# EAGLE design ina (EAGLE 7.7.0)
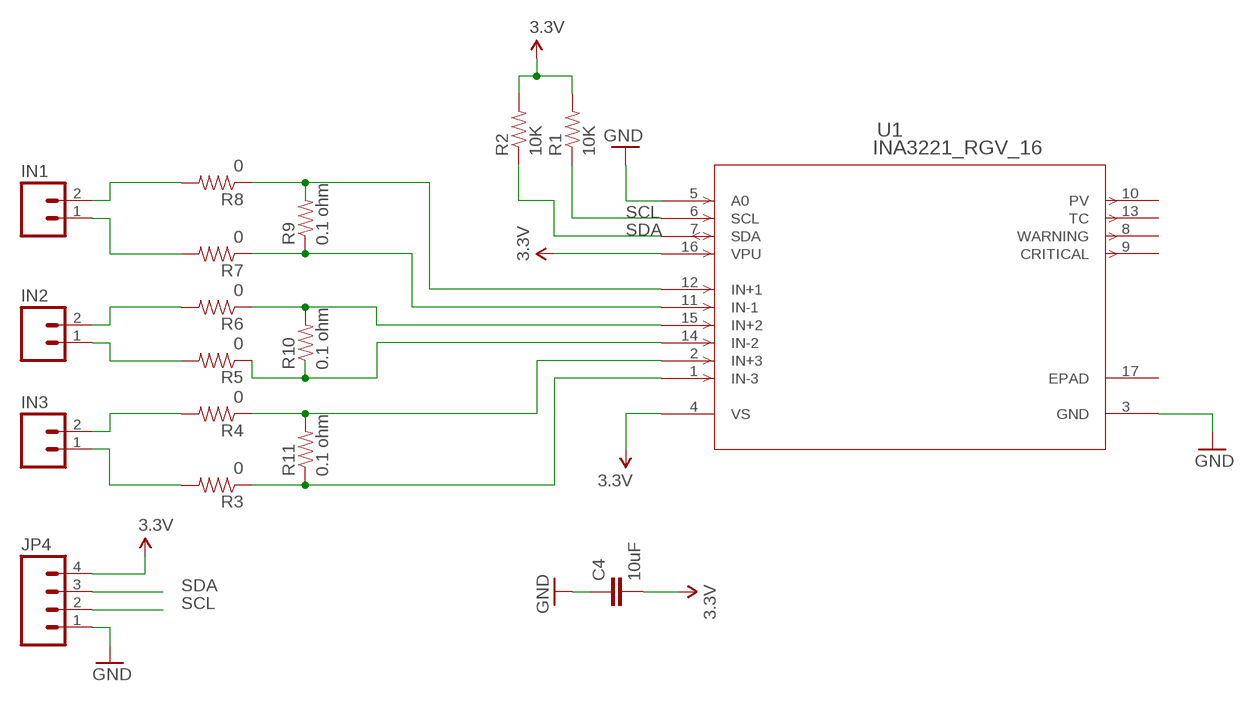
[diagram p0: schematic, sheet 1]

## Parts
C4  10uF  CAP1206  [1206]
IN1  M02PTH  [1X02]
IN2  M02PTH  [1X02]
IN3  M02PTH  [1X02]
JP4  M04LONGPADS  [1X04_LONGPADS]
R1  10K  RESISTOR1206  [1206]
R2  10K  RESISTOR1206  [1206]
R3  0  RESISTOR1206  [1206]
R4  0  RESISTOR1206  [1206]
R5  0  RESISTOR1206  [1206]
R6  0  RESISTOR1206  [1206]
R7  0  RESISTOR1206  [1206]
R8  0  RESISTOR1206  [1206]
R9  0.1 ohm  RESISTOR2512  [R2512]
R10  0.1 ohm  RESISTOR2512  [R2512]
R11  0.1 ohm  RESISTOR2512  [R2512]
U1  INA3221_RGV_16  [RGV16_2P16X2P16]

## Nets
3.3V: C4.2 JP4.4 R1.2 R2.2 U1.4(VS) U1.16(VPU)
GND: C4.1 JP4.1 U1.3(GND) U1.5(A0)
IN1_N: R7.1 R9.1 U1.11(IN-1)
IN1_P: R8.1 R9.2 U1.12(IN+1)
IN2_N: R5.1 R10.1 U1.14(IN-2)
IN2_P: R6.1 R10.2 U1.15(IN+2)
IN3_N: R3.1 R11.1 U1.1(IN-3)
IN3_P: R4.1 R11.2 U1.2(IN+3)
N$7: IN1.2 R8.2
N$8: IN1.1 R7.2
N$9: IN2.2 R6.2
N$10: IN2.1 R5.2
N$11: IN3.2 R4.2
N$12: IN3.1 R3.2
SCL: JP4.2 R1.1 U1.6(SCL)
SDA: JP4.3 R2.1 U1.7(SDA)
Unconnected: U1.8(WARNING) U1.9(CRITICAL) U1.10(PV) U1.13(TC) U1.17(EPAD)

## Library data of the parts
C4 = SparkFun-Passives:CAP: Capacitor Standard 0603 ceramic capacitor, and 0.1" leaded capacitor.; MF: WALSIN; MPN: 1206B106K160CT; OC_FARNELL: 2497081
IN1-IN3 = SparkFun-Connectors:M02: Standard 2-pin 0.1" header. Use with - straight break away headers ( PRT-00116) - right angle break away headers (PRT-00553) - swiss pins (PRT-00743) - machine pins (PRT-00117) - female headers (PRT-00115) Molex polarized connector foot print use with: PRT-08233 with associated crimp pins and housings. 2.54_SCREWTERM for use with PRT-10571. 3.5mm Screw Terminal footprints for PRT-08084 5mm Screw Terminal footprints for use with PRT-08432; OC_FARNELL: unknown
JP4 = SparkFun-Connectors:M04: Header 4 Standard 4-pin 0.1" header. Use with straight break away headers (SKU : PRT-00116), right angle break away headers (PRT-00553), swiss pins (PRT-00743), machine pins (PRT-00117), and female headers (PRT-00115). Molex polarized connector foot print use with SKU : PRT-08231 with associated crimp pins and housings. 1MM SMD Version SKU: PRT-10208; OC_FARNELL: unknown
R1 R2 = SparkFun-Passives:RESISTOR: Resistor Basic schematic elements and footprints for 0603, 1206, and PTH resistors.; MF: YAGEO (PHYCOMP); MPN: RC1206FR-0710KL; OC_FARNELL: 9241000
R3-R8 = SparkFun-Passives:RESISTOR: Resistor Basic schematic elements and footprints for 0603, 1206, and PTH resistors.; MF: WELWYN; MPN: WCR1206-R005JI; OC_FARNELL: 1100137
R9-R11 = SparkFun-Passives:RESISTOR: Resistor Basic schematic elements and footprints for 0603, 1206, and PTH resistors.; MF: BOURNS; MPN: CRM2512-JX-R100ELF; OC_FARNELL: 2321764
U1 = webcam:INA3221_RGV_16; DATASHEETURL: http://www.ti.com/lit/gpn/INA3221; FAMILY_NAME: Standard CMV - Digital Output; GENERIC_PART_NUMBER: INA3221; INDUSTRY_STD_PKG_TYPE: VQFN; MANUFACTURER: Texas Instruments; MF: TEXAS INSTRUMENTS; MPN: INA3221AIRGVT; OC_FARNELL: 2144251; PACKAGE_DESIGNATOR: RGV; PIN_COUNT: 16

## Board
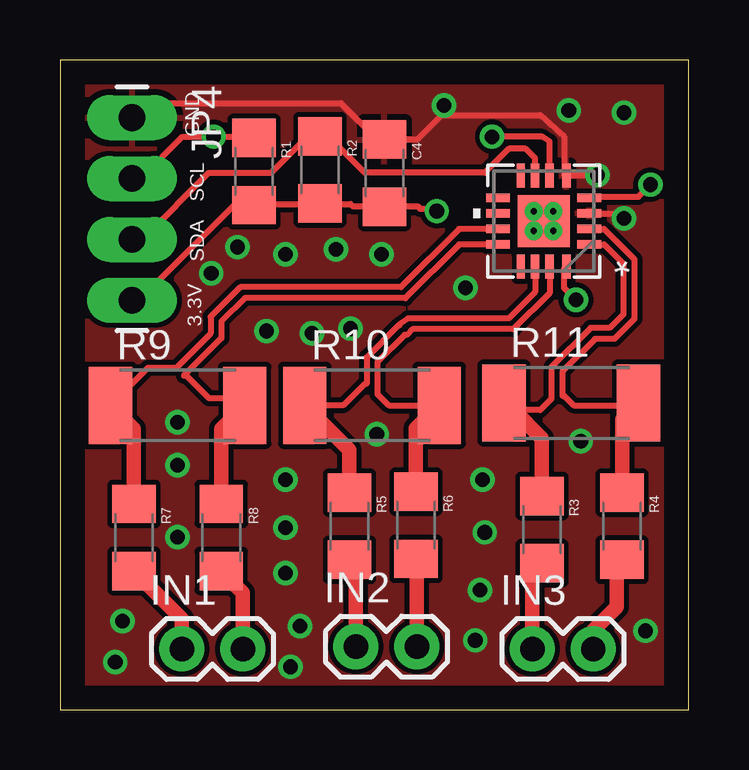
[diagram p1: board, top side]
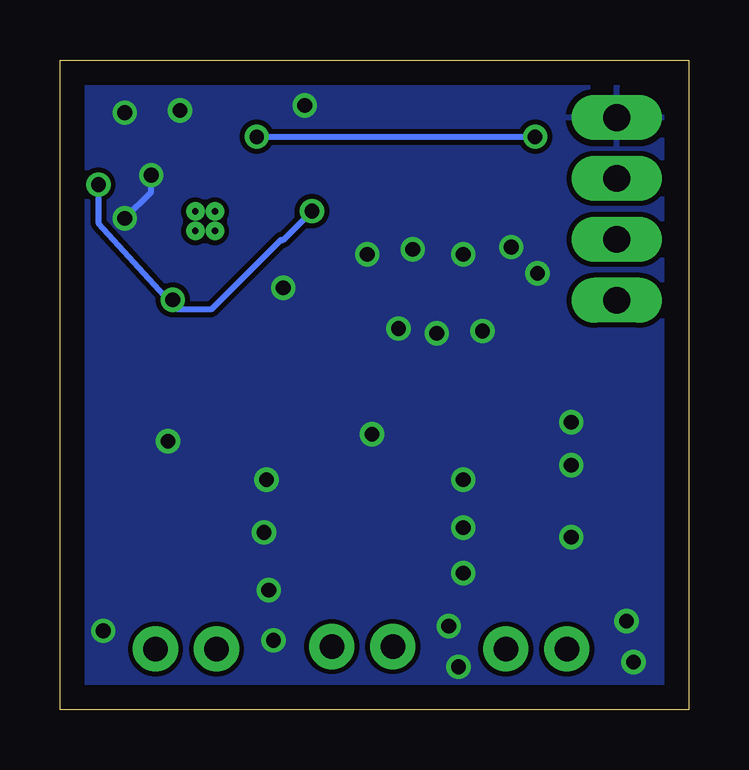
[diagram p2: board, bottom side, seen from below]

Size 26.2 x 27.1 mm. Coordinates in mm from the lower left corner, seen from the top.
Outline: 0,0 26.2,0 26.2,27.1 0,27.1 0,0
Copper layers (1*16): Top 0.035mm / dielectric 1.5mm / Bottom 0.035mm
Design rules "default": minimum track width 10mil, minimum drill 24mil, track to track 8mil, track to pad 8mil, pad to pad 8mil, via to via 8mil, smd to smd 8mil, copper to edge 40mil, drill to drill 8mil, minimum pad ring 10mil, minimum via ring 8mil, stop-mask expansion 4mil, vias tented up to drill 0mil, thermal gap 10mil

### Footprints (pad centres in the part's own frame; a part is rotated, then mirrored left to right if it is on the bottom)
1206 = smd 1.6 x 1.8: 1 -1.4,0; 2 1.4,0
1X02 = drill 1.016 pad 1.88: 1 0,0; 2 2.54,0
1X04_LONGPADS = drill 1.118 pad 1.88 long: 1 0,0; 2 2.54,0; 3 5.08,0; 4 7.62,0
R2512 = smd 1.8 x 3.2: 1 -2.8,0; 2 2.8,0
RGV16_2P16X2P16 = smd 1 x 0.35: 1 -1.9,0.975; 2 -1.9,0.325; 3 -1.9,-0.325; 4 -1.9,-0.975; 9 1.9,-0.975; 10 1.9,-0.325; 11 1.9,0.325; 12 1.9,0.975 | smd 0.35 x 1: 5 -0.95,-1.9; 6 -0.25,-1.9; 7 0.35,-1.9; 8 0.95,-1.9; 13 0.95,1.9; 14 0.35,1.9; 15 -0.25,1.9; 16 -0.95,1.9 | smd 2.16 x 2.16: 17 0,0 | drill 0.254 pad 0.508: V -0.406,-0.406; V_1 -0.406,0.406; V_2 0.406,-0.406; V_3 0.406,0.406

### Placement (x,y rotation side)
C4  13.52,22.38 270 top
IN1  5.08,2.54 0 top
IN2  12.33,2.64 0 top
IN3  19.68,2.54 0 top
JP4  3,24.7 270 top
R1  8.08,22.45 270 top
R2  10.83,22.52 270 top
R3  20.08,7.52 270 top
R4  23.42,7.66 270 top
R5  12.06,7.66 270 top
R6  14.83,7.7 270 top
R7  3.08,7.19 270 top
R8  6.72,7.19 270 top
R9  4.9,12.7 0 top
R10  13,12.7 0 top
R11  21.3,12.8 0 top
U1  20.15,20.38 180 top

### Tracks (layer width: path | path; a pad name or v marks a point on that pad's centre or on a via)
3.3V  (via drill 0.61)
  Top 0.254: JP4.4 3,17.1 3.3,17.1 7.3,21.1 8,21.1 R1.2 8.1,21.1 10.8,21.1 R2.2 10.9,21.1 12.1,21.1 12.2,21 13.5,21 C4.2 13.6,21 14.9,21 15,20.9 15.6,20.9 15.6,20.8 v15.7,20.8 | U1.4 22.1,21.4 24.1,21.4 v24.6,21.9 | v21.5,17.1 21,17.6 21,18.4 U1.16
  Bottom 0.254: v24.6,21.9 24.6,20.3 21.65,17.05 | 21.65,17.05 21.3,16.7 | 21.65,17.05 21.6,17.1 v21.5,17.1 21.2,16.7 19.9,16.7 17,19.6 16.9,19.6 v15.7,20.8
GND  (via drill 0.61)
  Top 0.254: JP4.1 3.6,25.3 11.7,25.3 13.2,23.8 13.5,23.8 C4.1 13.6,23.8 14.9,23.8 15.9,24.8 20,24.8 21,23.9 21,22.3 | 21,22.3 U1.5 | 21,22.3 v22.4,22.3 | v23.5,20.5 23.3,20.7 22.1,20.7 U1.3
  Bottom 0.254: v22.4,22.3 22.4,21.6 v23.5,20.5
  other vias: 7.4,19.3 9.4,19 11.5,19.2 13.4,19 2.3,2 8.6,15.8 10.5,15.7 12.1,15.9 10,3.5 9.6,1.8 17.3,2.9 23.5,24.9 21.2,25 16.9,17.6 16,25.2 6.3,18.2 9.4,9.6 9.4,7.6 9.4,5.7 17.6,9.6 17.7,7.4 17.5,5 4.9,12 4.9,10.2 13.2,11.5 21.7,11.2 24.4,3.3 2.6,3.7 4.9,7.2
  pour Bottom: 0,27.2 0,-0.1 26.1,-0.1 26.1,27.1 0.1,27.1
  pour Top: 0.1,27 26.2,27 26.2,27.1 26.3,27.1 26.3,0 0,0 0,27.1
IN1_N
  Top 0.254: U1.11 16.63,20.05 14.21,17.63 7.5,17.63 6.27,16.39 6.27,15.7 4.84,14.26 3.66,14.26 R9.1
  Top 0.61: R7.1 3.08,11.72 R9.1
IN1_P
  Top 0.254: U1.12 16.63,19.41 14.39,17.17 7.7,17.17 6.73,16.2 6.73,15.51 5.16,13.94 5.26,13.94 6.2,13 7.4,13 R9.2
  Top 0.61: R8.1 6.72,11.72 R9.2
IN2_N
  Top 0.254: U1.14 19.8,17.42 18.7,16.33 14.51,16.33 14.14,16.06 14.14,16.04 14.12,16.04 12.77,14.7 12.77,13.6 12.7,13.6 11.8,12.7 R10.1
  Top 0.61: R5.1 12.06,10.84 R10.1
IN2_P
  Top 0.254: U1.15 20.4,17.38 18.89,15.87 14.7,15.87 14.46,15.64 14.36,15.64 13.23,14.51 13.23,13.17 13.7,12.7 R10.2
  Top 0.61: R6.1 14.83,11.73 R10.2
IN3_N
  Top 0.254: U1.1 22.67,19.41 23.47,18.61 23.47,16.5 22.91,15.93 22.11,15.93 20.47,14.29 20.47,12.97 20,12.5 18.9,12.5 18.8,12.5 R11.1
  Top 0.61: R3.1 20.08,11.32 18.9,12.5
IN3_P
  Top 0.254: U1.2 22.67,20.05 23.93,18.8 23.93,16.3 23.09,15.47 22.3,15.47 20.93,14.11 20.93,13.1 21,13.1 21.4,12.7 24,12.7 R11.2
  Top 0.61: R4.1 23.42,12.12 R11.2
N$7
  Top 0.61: IN1.2 7.62,4.89 R8.2
N$8
  Top 0.61: IN1.1 5.08,3.79 R7.2
N$9
  Top 0.61: IN2.2 14.87,6.26 R6.2
N$10
  Top 0.61: IN2.1 12.33,5.99 R5.2
N$11
  Top 0.61: IN3.2 22.22,3.32 23.2,4.3 23.2,6.04 R4.2
N$12
  Top 0.61: IN3.1 19.68,5.72 R3.2
SCL  (via drill 0.6)
  Top 0.254: U1.6 20.4,23.7 20.1,23.9 v18,23.9 | R1.1 8,23.9 v6.4,23.9 5.1,23.9 3.4,22.2 3,22.2 JP4.2
  Bottom 0.254: v18,23.9 v6.4,23.9
SDA
  Top 0.254: JP4.3 3,19.7 3.5,19.7 6.2,22.4 8.8,22.4 10.3,23.9 10.8,23.9 R2.1 10.9,23.9 11.2,23.9 12.7,22.4 17.7,22.4 18.7,23.4 19.4,23.4 19.8,23 U1.7

### Text on the board
tPlace: GND | SCL | SDA | 3.3V